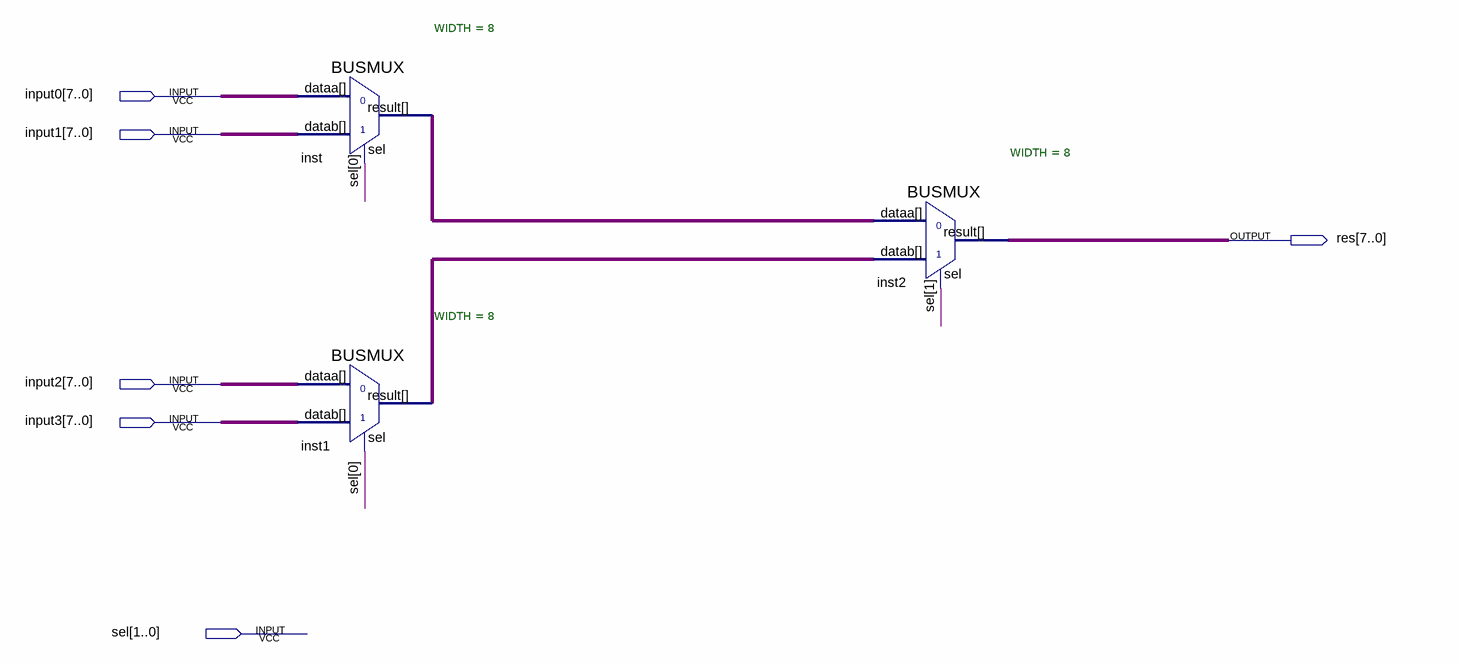
[diagram p0: schematic sheet]
// Quartus schematic mux4to1_8bit.bdf as structural Verilog: 3 symbols, 6 pins
module mux4to1_8bit (
  input  [7:0] input0,
  input  [7:0] input1,
  input  [7:0] input2,
  input  [7:0] input3,
  input  [1:0] sel,
  output [7:0] res
);

  wire [7:0] inst1_result, inst_result;

  BUSMUX #(.WIDTH(8)) inst (.datab(input1), .sel(sel[0]), .dataa(input0), .result(inst_result));
  BUSMUX #(.WIDTH(8)) inst1 (.datab(input3), .sel(sel[0]), .dataa(input2), .result(inst1_result));
  BUSMUX #(.WIDTH(8)) inst2 (.datab(inst1_result), .sel(sel[1]), .dataa(inst_result), .result(res));
endmodule
